# Altium schematic sheet node-test-array.SchDoc
size D; Organization: Altium Limited; Address1: 3 Minna Close; Address2: Belrose; Address3: NSW 2085; Address4: Australia; SheetNumber: 1; SheetTotal: 2; PAGE_TITLE: -
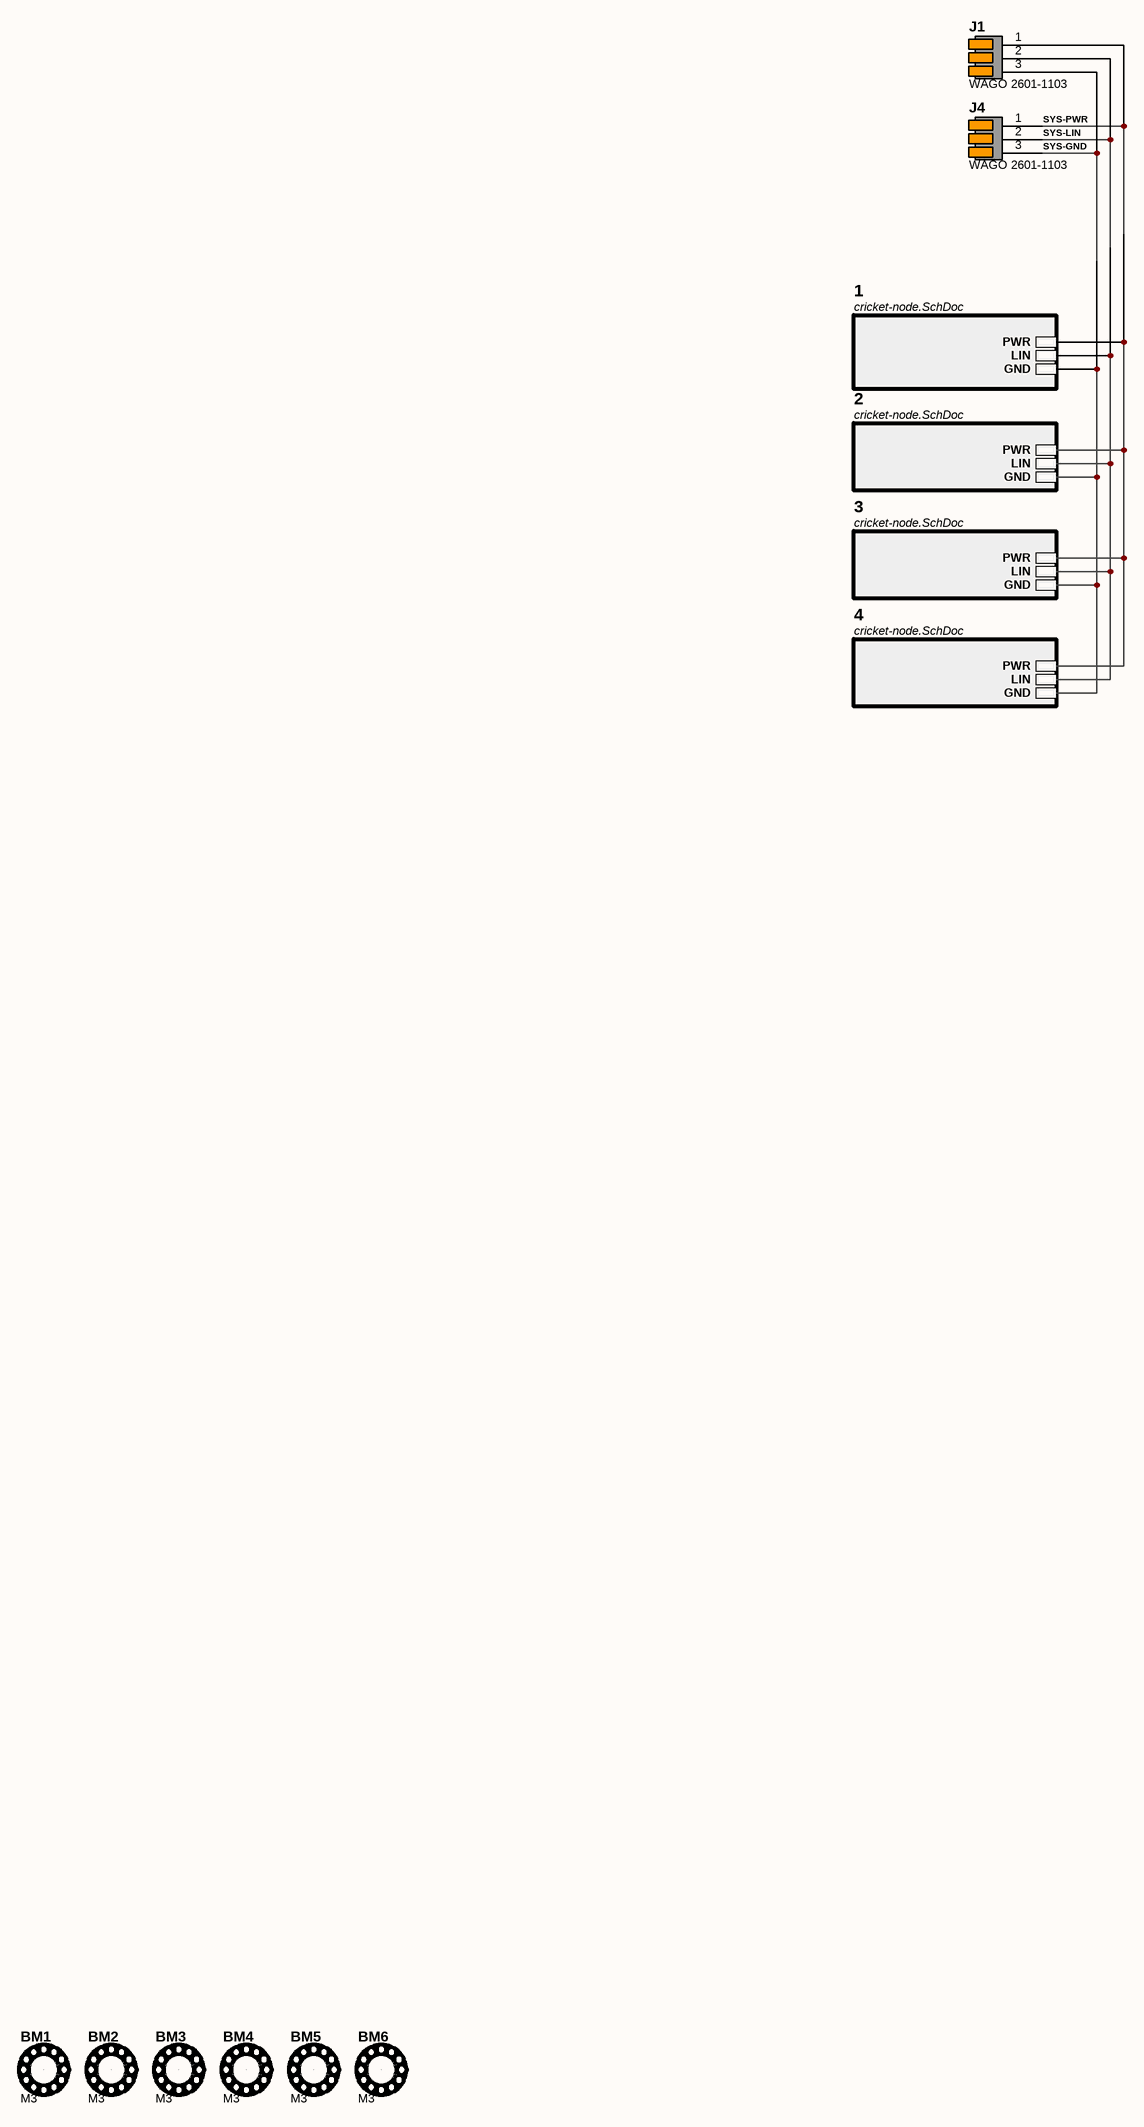
[diagram p0: node-test-array.SchDoc]

## Parts
BM1  M3  [M3]  (no BOM)
BM2  M3  [M3]  (no BOM)
BM3  M3  [M3]  (no BOM)
BM4  M3  [M3]  (no BOM)
BM5  M3  [M3]  (no BOM)
BM6  M3  [M3]  (no BOM)
J1  WAGO 2601-1103  [2601-1103]
J4  WAGO 2601-1103  [2601-1103]

## Sub-sheets
1 = cricket-node.SchDoc: PWR, GND, LIN
2 = cricket-node.SchDoc: PWR, GND, LIN
3 = cricket-node.SchDoc: PWR, GND, LIN
4 = cricket-node.SchDoc: PWR, GND, LIN

## Nets
SYS-GND: J1.3 J4.3 ; sheet 1/GND, sheet 2/GND, sheet 3/GND, sheet 4/GND
SYS-LIN: J1.2 J4.2 ; sheet 1/LIN, sheet 2/LIN, sheet 3/LIN, sheet 4/LIN
SYS-PWR: J1.1 J4.1 ; sheet 1/PWR, sheet 2/PWR, sheet 3/PWR, sheet 4/PWR

Not connected (* = marked no-connect by the designer): BM1 1; BM2 1; BM3 1; BM4 1; BM5 1; BM6 1

## Notes on the sheet
- Part Number
- Document Type
- SCHEMATIC DRAWING
- PCB Mixdown
- CCA Mixdown
- Codename
- Engineer
- Date
- Status
- Page

## Library data of the parts
BM1-BM6 = M3: M3 screw hole ISO standard 3.6mm clearance 16 conductivity holes 6.3mm pad size; Manufacturer: Wavenumber; kicad-symbol: screw-hole:screw-hole; kicad-footprint: M3:M3; flags: NO_BOM; Value: M3; cad-reference: M3; Manufacturer Part Number: M3; Category: Screw Mount
J1 J4 = 2601-1103: 3 Position Wire to Board Terminal Block Horizontal with Board 0.137" (3.50mm) Through Hole; kicad-symbol: 2601-1103:2601-1103; Value: 2601-1103; cad-reference: 2601-1103; kicad-footprint: 2601-1103:2601-1103; Internal Part Number: 2601-1103; Manufacturer: Wago; Manufacturer Part Number: 2601-1103; Category: connectors